# EAGLE design B104B (EAGLE 6.6.0)
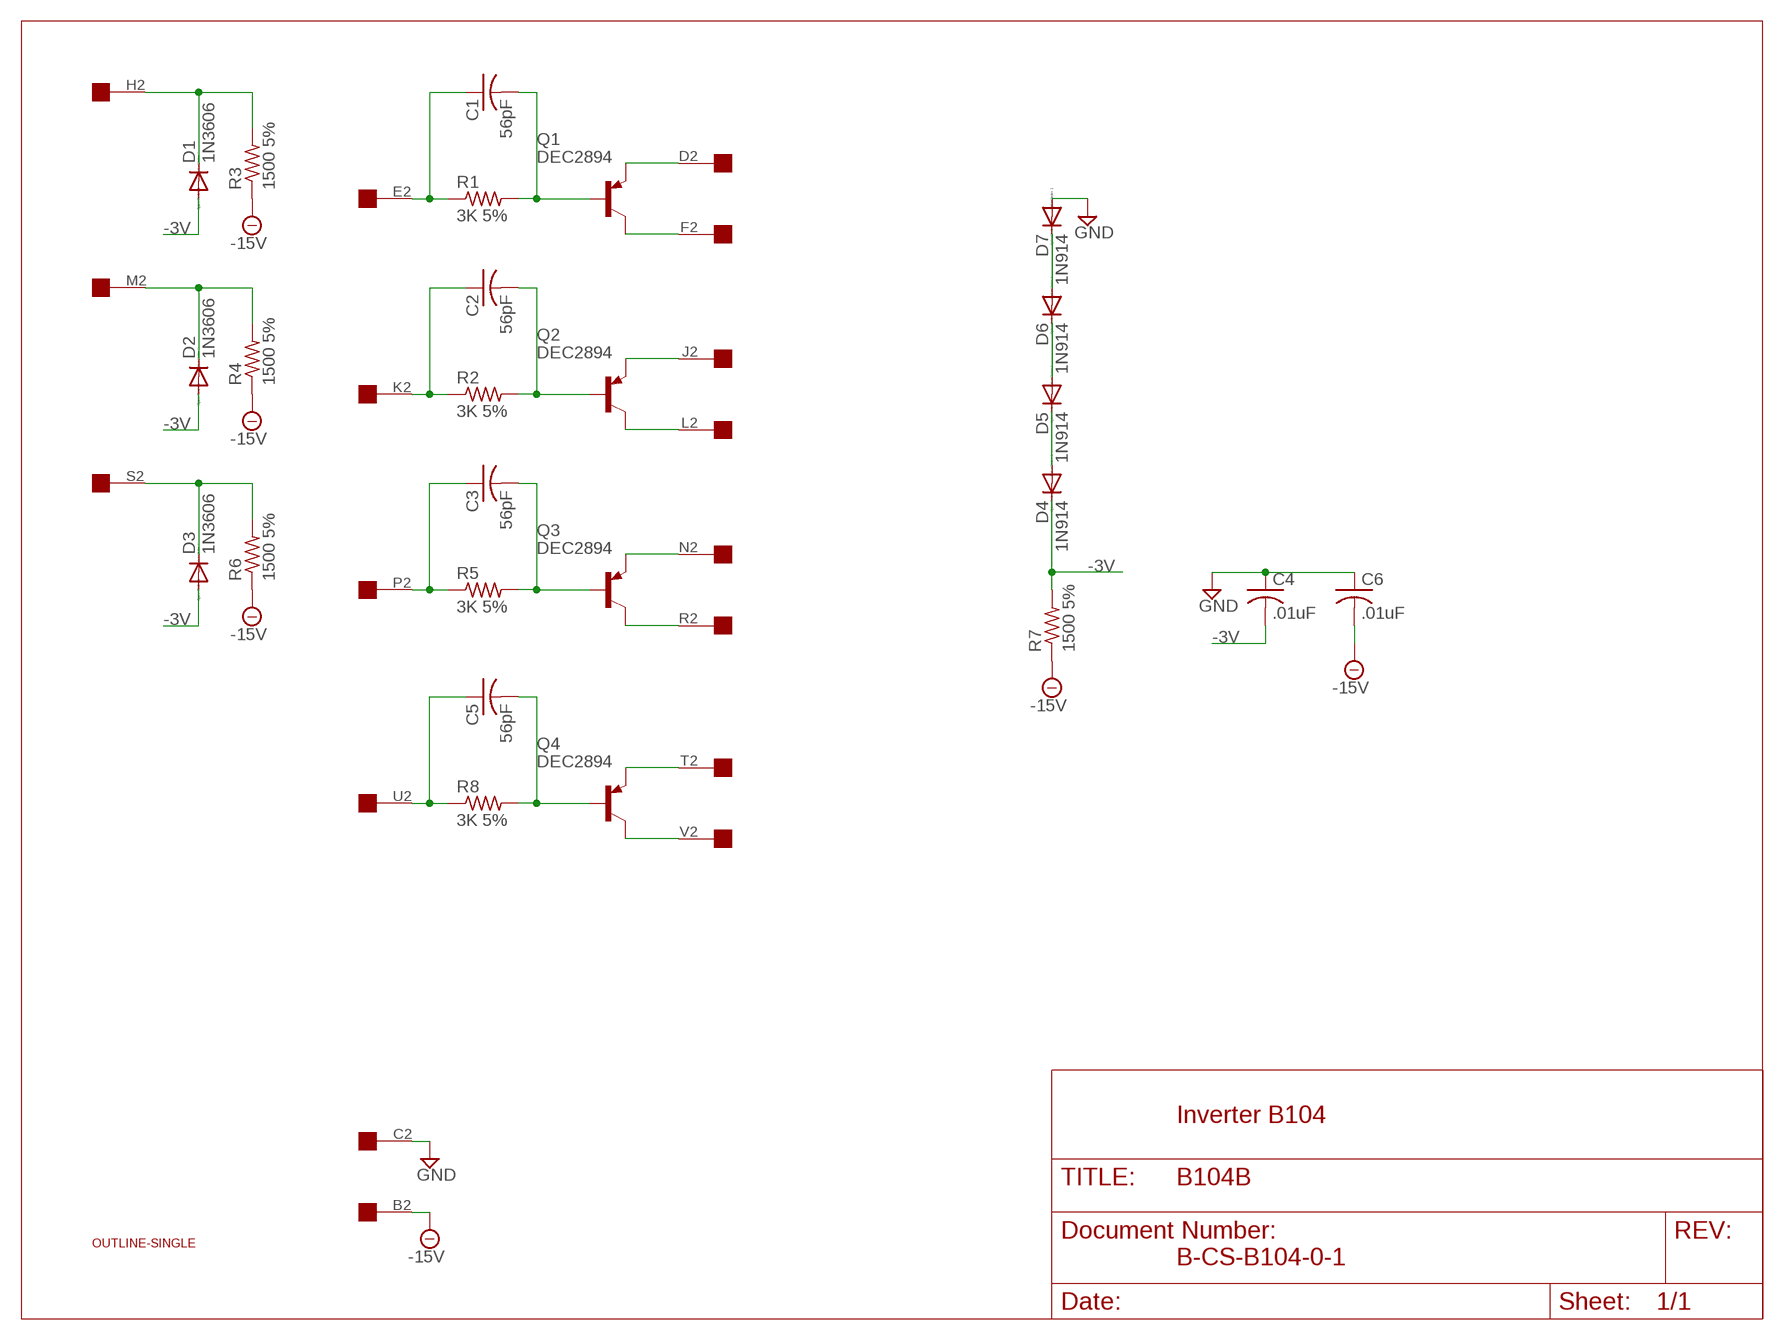
[diagram p0: schematic, sheet 1]

## Parts
C1  56pF  C-US075-032X103  [C075-032X103]
C2  56pF  C-US075-032X103  [C075-032X103]
C3  56pF  C-US075-032X103  [C075-032X103]
C4  .01uF  C-US050-025X075  [C050-025X075]
C5  56pF  C-US075-032X103  [C075-032X103]
C6  .01uF  C-US050-025X075  [C050-025X075]
D1  1N3606  1N4148DO35-10  [DO35-10]
D2  1N3606  1N4148DO35-10  [DO35-10]
D3  1N3606  1N4148DO35-10  [DO35-10]
D4  1N914  1N4148DO35-10  [DO35-10]
D5  1N914  1N4148DO35-10  [DO35-10]
D6  1N914  1N4148DO35-10  [DO35-10]
D7  1N914  1N4148DO35-10  [DO35-10]
Q1  DEC2894  2N2904  [TO39]
Q2  DEC2894  2N2904  [TO39]
Q3  DEC2894  2N2904  [TO39]
Q4  DEC2894  2N2904  [TO39]
R1  3K 5%  R-US_0207/10  [0207/10]
R2  3K 5%  R-US_0207/10  [0207/10]
R3  1500 5%  R-US_0207/10  [0207/10]
R4  1500 5%  R-US_0207/10  [0207/10]
R5  3K 5%  R-US_0207/10  [0207/10]
R6  1500 5%  R-US_0207/10  [0207/10]
R7  1500 5%  R-US_0207/10  [0207/10]
R8  3K 5%  R-US_0207/10  [0207/10]
U$1  OUTLINE-SINGLE  [SINGLE]
U$2  EDGE-1  [EDGE-CON1]

## Nets
-3V [Supply]: C4.2 D1.A D2.A D3.A D4.C R7.2
-15V: C6.2 R3.1 R4.1 R6.1 R7.1 U$2.B2
GND [Supply]: C4.1 C6.1 D7.A U$2.C2
N$1: C1.1 R1.1 U$2.E2
N$2: Q1.1(E) U$2.D2
N$3: C1.2 Q1.2(B) R1.2
N$4: Q1.3(C) U$2.F2
N$5: D1.C R3.2 U$2.H2
N$6: C2.1 R2.1 U$2.K2
N$7: Q2.1(E) U$2.J2
N$8: C2.2 Q2.2(B) R2.2
N$9: Q2.3(C) U$2.L2
N$10: D2.C R4.2 U$2.M2
N$11: C3.1 R5.1 U$2.P2
N$12: Q3.1(E) U$2.N2
N$13: C3.2 Q3.2(B) R5.2
N$14: Q3.3(C) U$2.R2
N$15: D3.C R6.2 U$2.S2
N$16: C5.1 R8.1 U$2.U2
N$17: Q4.1(E) U$2.T2
N$18: C5.2 Q4.2(B) R8.2
N$19: Q4.3(C) U$2.V2
N$26: D6.A D7.C
N$27: D5.A D6.C
N$29: D4.A D5.C
Unconnected: U$2.A2

## Notes on the sheet
- Inverter B104
- B-CS-B104-0-1

## Library data of the parts
C1-C6 = rcl:C-US: CAPACITOR, American symbol
D1-D7 = diode:1N4148: DIODE high speed (Philips)
Q1-Q4 = transistor-pnp:2N2904*: PNP Transistror
R1-R8 = rcl:R-US_: RESISTOR, American symbol
U$1 = dec-con:OUTLINE-*: Board outlines for DEC boards.
U$2 = dec-con:EDGE-1: Single-Sided DEC Edge Connector -- (side 2)

## Net classes
1 Supply: width 0.813 mm

## Board
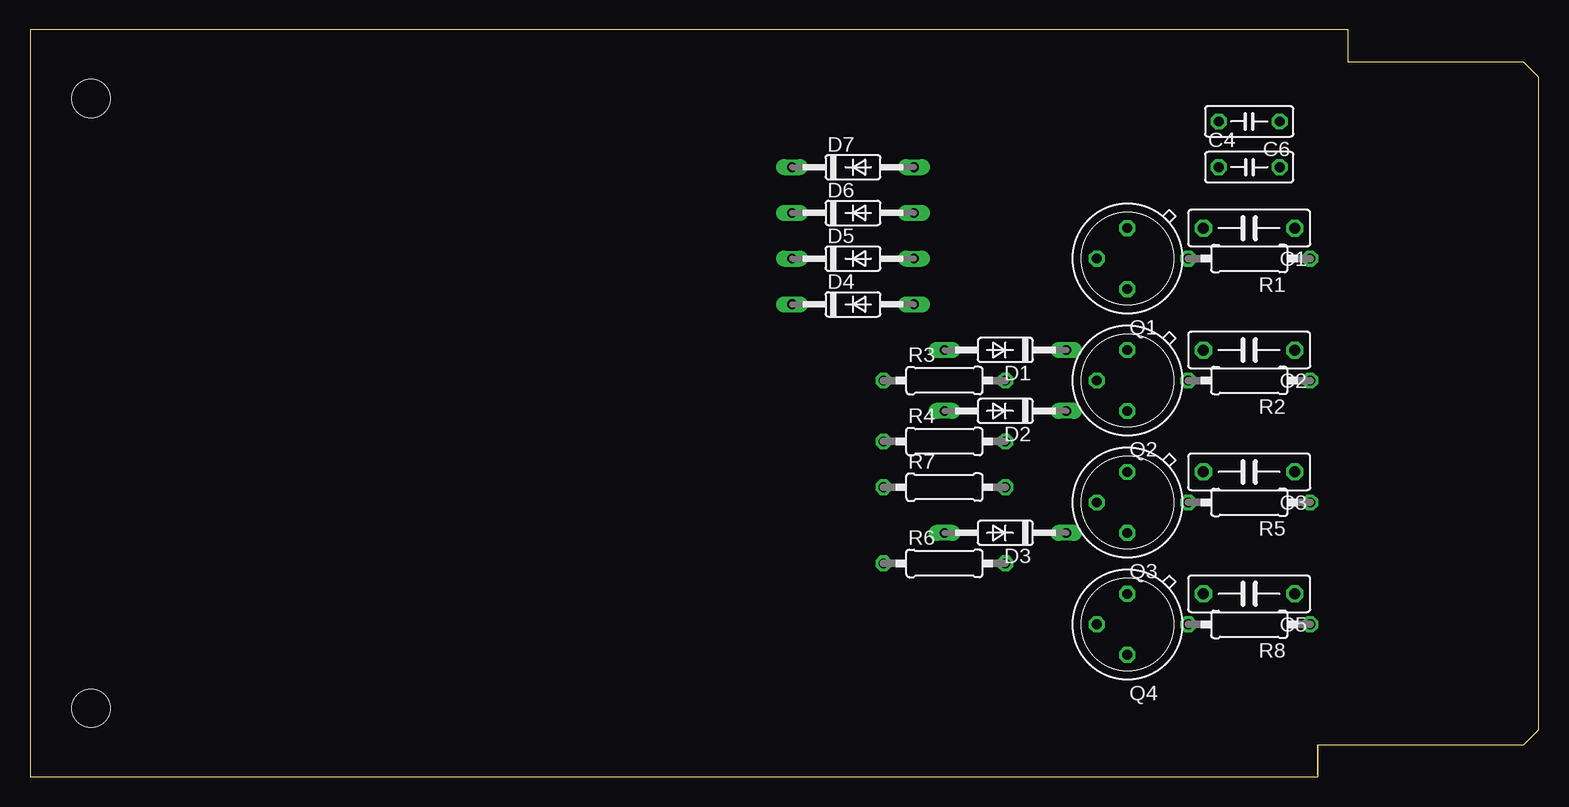
[diagram p1: board, top side]
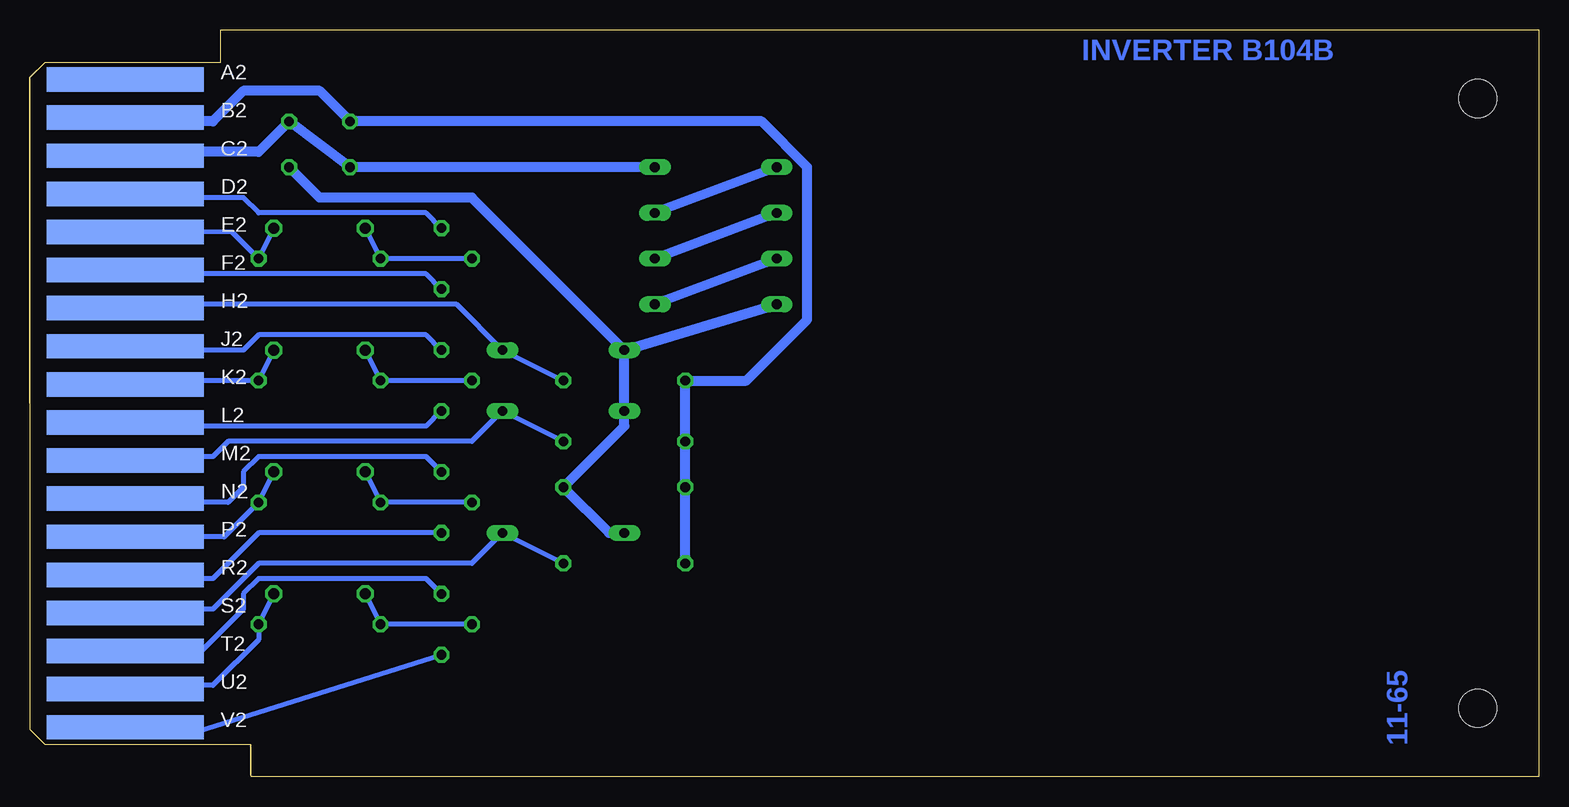
[diagram p2: board, bottom side, seen from below]

Size 125.73 x 62.23 mm. Coordinates in mm from the lower left corner, seen from the top.
Copper layers (1+16): Top 0.035mm / dielectric 1.5mm / Bottom 0.035mm
Design rules "16mils": minimum track width 16mil, minimum drill 32mil, track to track 15mil, track to pad 10mil, pad to pad 10mil, via to via 10mil, smd to smd 10mil, copper to edge 13mil, drill to drill 10mil, minimum pad ring 10mil, minimum via ring 8mil, stop-mask expansion 0mil, vias tented up to drill 0mil, thermal gap 10mil

### Footprints (pad centres in the part's own frame; a part is rotated, then mirrored left to right if it is on the bottom)
C075-032X103 = drill 0.914 octagon: 1 -3.81,0; 2 3.81,0
C050-025X075 = drill 0.813 octagon: 1 -2.54,0; 2 2.54,0
DO35-10 = drill 0.813 long: A 5.08,0; C -5.08,0
TO39 = drill 0.813 octagon: 1 0,-2.54; 2 2.54,0; 3 0,2.54
0207/10 = drill 0.813 octagon: 1 -5.08,0; 2 5.08,0
SINGLE = hole 3.175: 120.65,56.515; 120.65,5.715
EDGE-CON1 = smd 13.106 x 2.032 bottom: A2 7.938,4.128; B2 7.938,7.303; C2 7.938,10.477; D2 7.938,13.652; E2 7.938,16.828; F2 7.938,20.003; H2 7.938,23.177; J2 7.938,26.352; K2 7.938,29.527; L2 7.938,32.703; M2 7.938,35.877; N2 7.938,39.053; P2 7.938,42.227; R2 7.938,45.403; S2 7.938,48.578; T2 7.938,51.752; U2 7.938,54.928; V2 7.938,58.102

### Placement (x,y rotation side)
C1  101.6,45.72 180 top
C2  101.6,35.56 180 top
C3  101.6,25.4 180 top
C4  101.6,50.8 0 top
C5  101.6,15.24 180 top
C6  101.6,54.61 180 top
D1  81.28,35.56 180 top
D2  81.28,30.48 180 top
D3  81.28,20.32 180 top
D4  68.58,39.37 0 top
D5  68.58,43.18 0 top
D6  68.58,46.99 0 top
D7  68.58,50.8 0 top
Q1  91.44,43.18 180 top
Q2  91.44,33.02 180 top
Q3  91.44,22.86 180 top
Q4  91.44,12.7 180 top
R1  101.6,43.18 180 top
R2  101.6,33.02 180 top
R3  76.2,33.02 0 top
R4  76.2,27.94 0 top
R5  101.6,22.86 180 top
R6  76.2,17.78 0 top
R7  76.2,24.13 0 top
R8  101.6,12.7 180 top
U$1  125.73,62.23 180 top
U$2  125.73,62.23 180 top

### Tracks (layer width: path | path; a pad name or v marks a point on that pad's centre or on a via)
-3V
  Bottom 0.813: D1.A D4.C | D1.A D2.A 76.2,29.21 R7.2 77.47,20.32 D3.A | C4.2 101.6,48.26 88.9,48.26 D1.A
-15V
  Bottom 0.813: U$2.B2 117.13,54.9 116.84,54.61 110.49,54.61 107.95,57.15 101.6,57.15 C6.2 64.77,54.61 60.96,50.8 60.96,38.1 66.04,33.02 R3.1 R4.1 R7.1 R6.1
GND
  Bottom 0.813: U$2.C2 117.17,51.74 116.84,52.07 106.68,52.07 C6.1 C4.1 D7.A
N$1
  Bottom 0.406: C1.1 R1.1 108.89,45.39 U$2.E2
N$2
  Bottom 0.406: Q1.1 92.71,46.99 106.68,46.99 107.95,48.26 114.3,48.26 114.61,48.56 U$2.D2
N$3
  Bottom 0.406: Q1.2 R1.2 C1.2
N$4
  Bottom 0.406: U$2.F2 114.58,42.19 114.3,41.91 92.71,41.91 Q1.3
N$5
  Bottom 0.406: R3.2 D1.C 90.17,39.37 116.84,39.37 117.17,39.04 U$2.H2
N$6
  Bottom 0.406: U$2.K2 117.14,32.72 116.84,33.02 R2.1 C2.1
N$7
  Bottom 0.406: U$2.J2 117.17,35.89 116.84,35.56 107.95,35.56 106.68,36.83 92.71,36.83 Q2.1
N$8
  Bottom 0.406: C2.2 R2.2 Q2.2
N$9
  Bottom 0.406: U$2.L2 117.17,29.54 116.84,29.21 92.71,29.21 Q2.3
N$10
  Bottom 0.406: R4.2 D2.C 88.9,27.94 109.22,27.94 110.49,26.67 116.84,26.67 117.17,26.34 U$2.M2
N$11
  Bottom 0.406: C3.1 R5.1 109.55,19.99 U$2.P2
N$12
  Bottom 0.406: Q3.1 92.71,26.67 106.68,26.67 107.95,25.4 107.95,24.13 109.22,22.86 116.84,22.86 117.17,23.19 U$2.N2
N$13
  Bottom 0.406: Q3.2 R5.2 C3.2
N$14
  Bottom 0.406: U$2.R2 117.17,16.84 116.84,16.51 110.49,16.51 106.68,20.32 Q3.3
N$15
  Bottom 0.406: R6.2 D3.C 88.9,17.78 106.68,17.78 110.49,13.97 116.84,13.97 117.14,13.66 U$2.S2
N$16
  Bottom 0.406: U$2.U2 117.2,7.26 116.84,7.62 110.49,7.62 106.68,11.43 R8.1 C5.1
N$17
  Bottom 0.406: Q4.1 92.71,16.51 106.68,16.51 107.95,15.24 107.95,13.97 111.76,10.16 116.84,10.16 117.17,10.49 U$2.T2
N$18
  Bottom 0.406: C5.2 R8.2 Q4.2
N$19
  Bottom 0.406: U$2.V2 115.89,4.13 115.57,3.81 111.76,3.81 Q4.3
N$26
  Bottom 0.813: D7.C D6.A
N$27
  Bottom 0.813: D6.C D5.A
N$29
  Bottom 0.813: D5.C D4.A

### Text on the board
Bottom: INVERTER B104B | 11-65